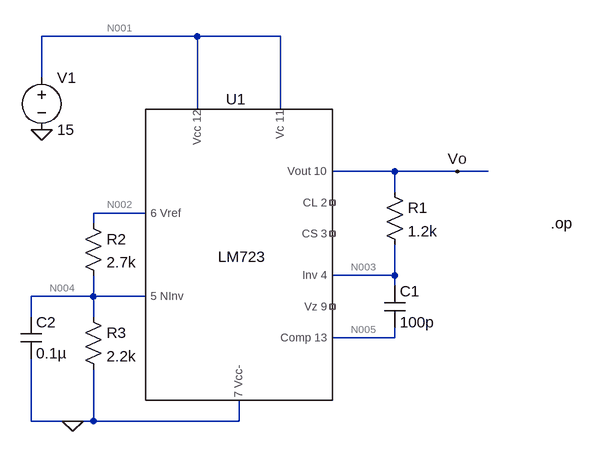
[diagram p0: schematic low voltage regulator.asc]
low voltage regulator.asc, the LTspice schematic file:
Version 4
SHEET 1 880 680
WIRE 80 -208 -160 -208
WIRE 208 -208 80 -208
WIRE -160 -144 -160 -208
WIRE 80 -96 80 -208
WIRE 208 -96 208 -208
WIRE 384 0 288 0
WIRE 480 0 384 0
WIRE 528 0 480 0
WIRE 384 32 384 0
WIRE 0 64 -80 64
WIRE -80 80 -80 64
WIRE 384 160 384 112
WIRE 384 160 288 160
WIRE 384 176 384 160
WIRE -80 192 -80 160
WIRE -80 192 -176 192
WIRE 0 192 -80 192
WIRE -176 224 -176 192
WIRE -80 224 -80 192
WIRE 384 256 384 240
WIRE 384 256 288 256
WIRE -176 384 -176 288
WIRE -112 384 -176 384
WIRE -80 384 -80 304
WIRE -80 384 -112 384
WIRE 144 384 144 352
WIRE 144 384 -80 384
FLAG -112 384 0
FLAG -160 -64 0
FLAG 480 0 Vo
SYMBOL LM723 144 32 R0
SYMATTR InstName U1
SYMBOL res 368 16 R0
SYMATTR InstName R1
SYMATTR Value 1.2k
SYMBOL cap 368 176 R0
SYMATTR InstName C1
SYMATTR Value 100p
SYMBOL res -96 64 R0
SYMATTR InstName R2
SYMATTR Value 2.7k
SYMBOL res -96 208 R0
SYMATTR InstName R3
SYMATTR Value 2.2k
SYMBOL cap -192 224 R0
SYMATTR InstName C2
SYMATTR Value 0.1µ
SYMBOL voltage -160 -160 R0
WINDOW 123 0 0 Left 0
WINDOW 39 0 0 Left 0
SYMATTR InstName V1
SYMATTR Value 15
TEXT 624 80 Left 2 !.op

The netlist it stands for:
* low voltage regulator.asc
XU1 NC_01 NC_02 N003 N004 N002 0 NC_03 Vo N001 N001 N005 LM723  ; pins CL_2 CS_3 Inv_4 5_NInv 6_Vref 7_Vcc- Vz_9 Vout_10 Vc_11 Vcc_12 Comp_13
R1 Vo N003 1.2k
C1 N003 N005 100p
R2 N002 N004 2.7k
R3 N004 0 2.2k
C2 N004 0 0.1µ
V1 N001 0 15
.op
.lib lm723.sub
.backanno
.end

* Results of the author's LTspice run, read from the files saved beside the schematic
* Operating Point:
*   V(n001) = 15 V
*   V(n005) = 3.899 V
*   V(n004) = 3.188 V
*   V(n003) = 3.189 V
*   V(n002) = 7.128 V
*   V(vo) = 3.202 V
*   I(C2) = 0 A
*   I(C1) = 0 A
*   I(R3) = 1.449 mA
*   I(R2) = 1.459 mA
*   I(R1) = 10.65 µA
*   I(V1) = -1.206 mA
*   Ix(u1:2) = 0 A
*   Ix(u1:3) = 0 A
*   Ix(u1:4) = 10.65 µA
*   Ix(u1:5) = 10.17 µA
*   Ix(u1:6) = -1.459 mA
*   Ix(u1:7) = 243.3 µA
*   Ix(u1:9) = 0 A
*   Ix(u1:10) = -10.65 µA
*   Ix(u1:11) = 16.45 pA
*   Ix(u1:12) = 1.206 mA
*   Ix(u1:13) = 0 A